# Altium schematic sheet 15_PowerSupply.SchDoc: Board power supply (part 2 of 3)
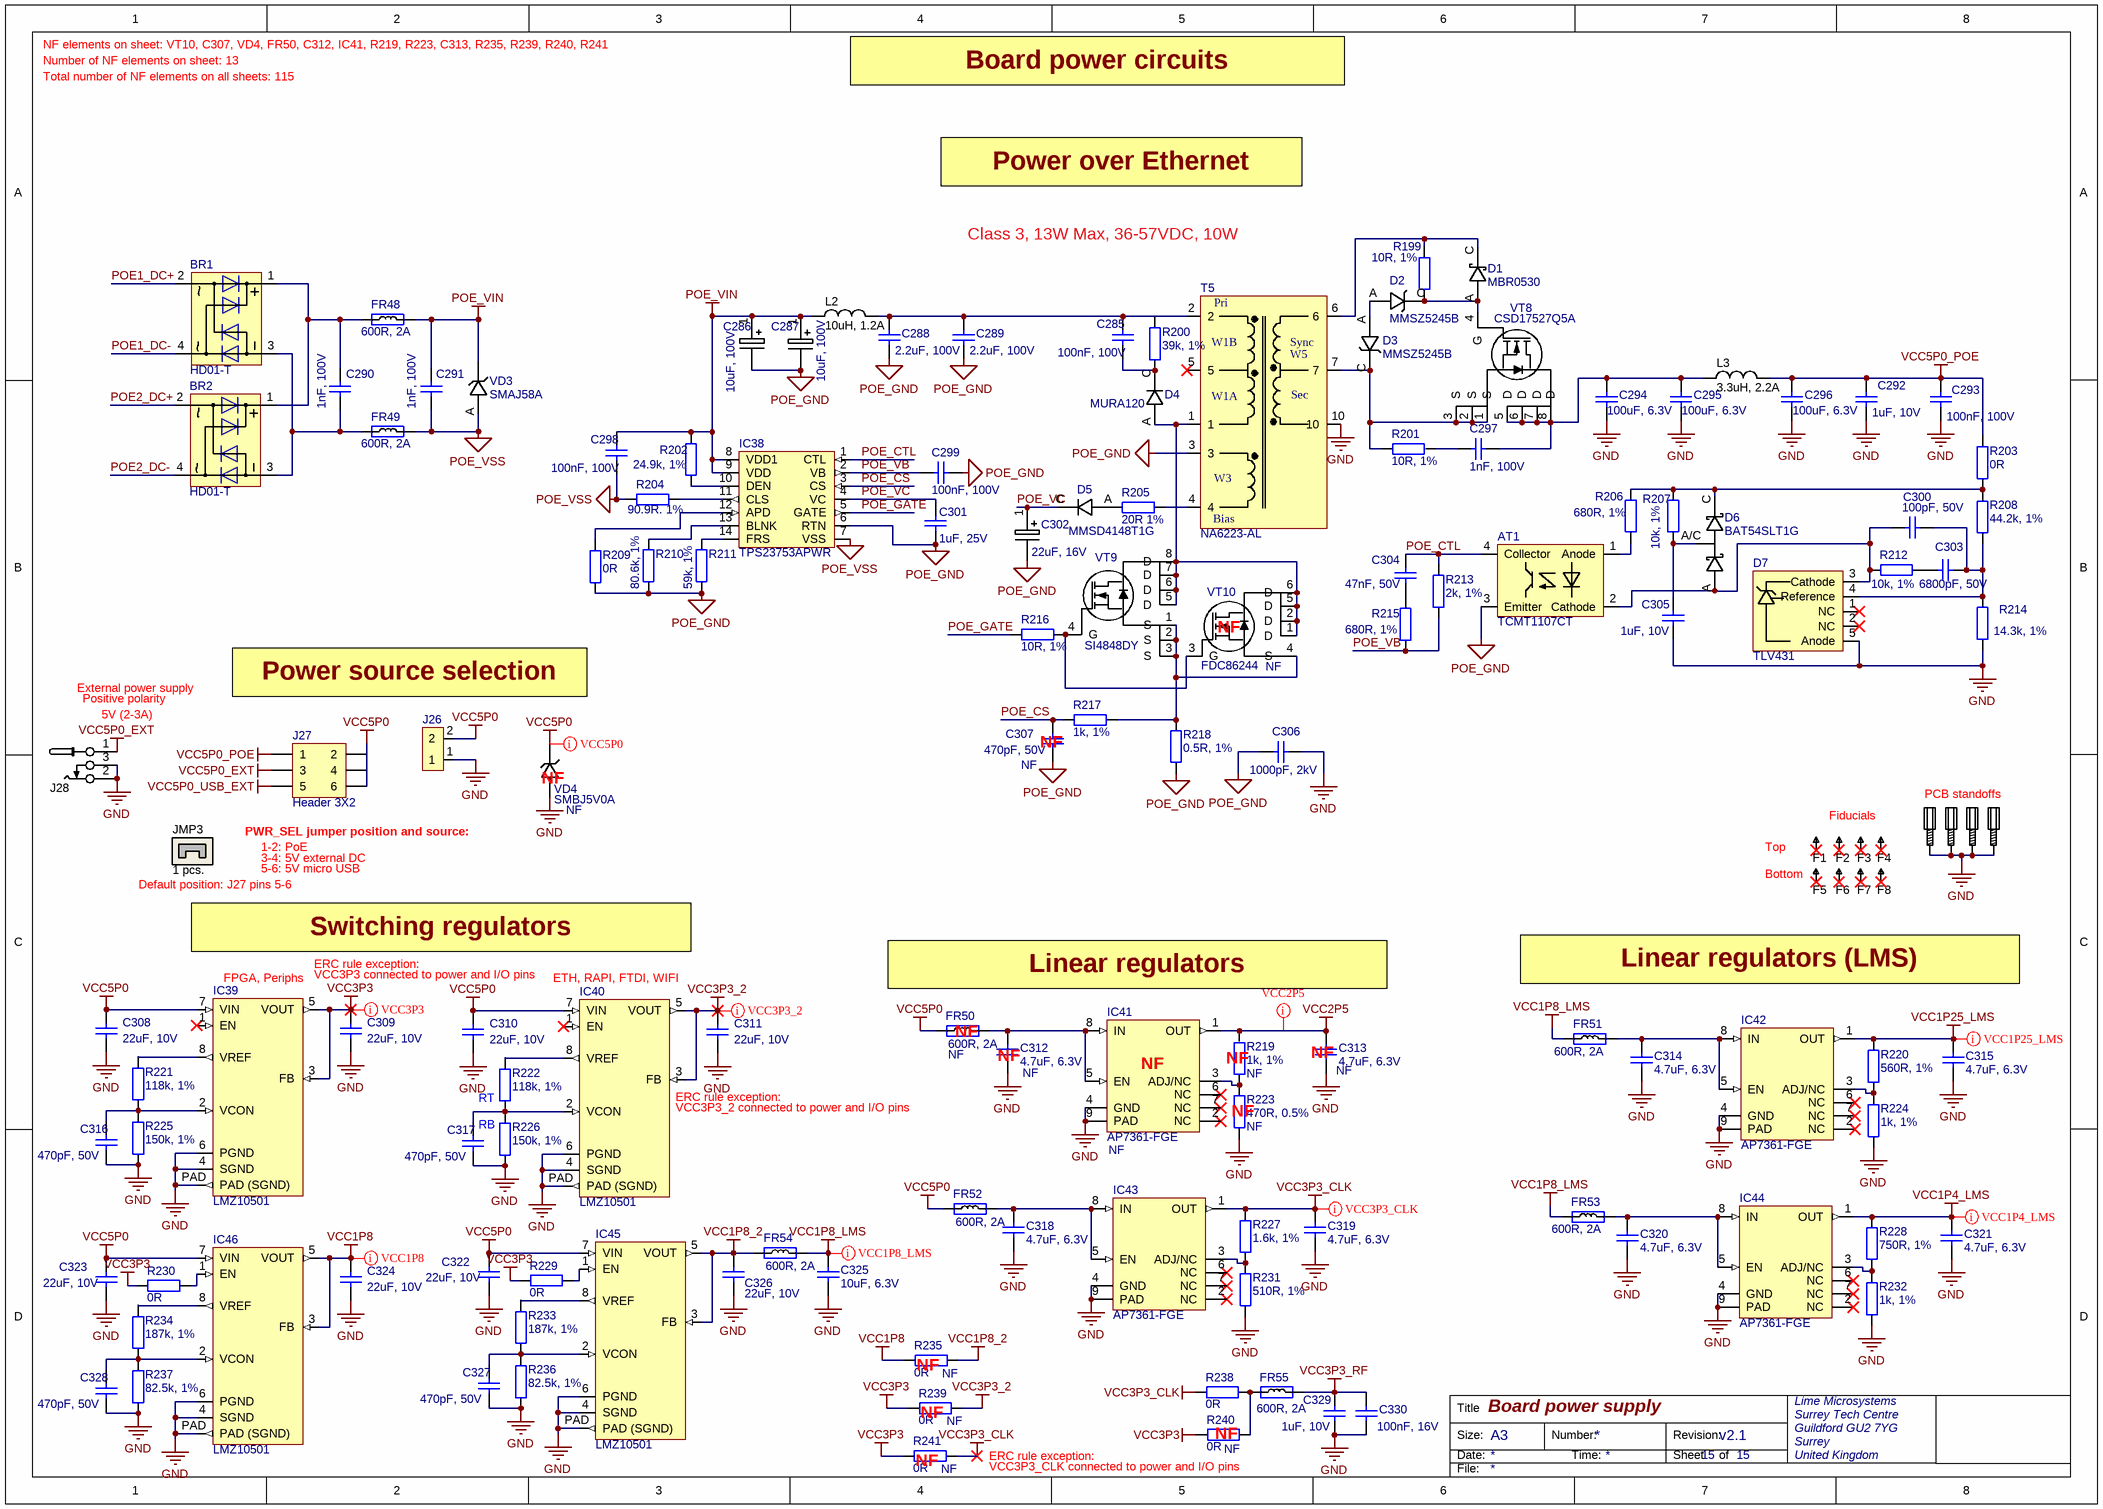
[diagram p1: 15_PowerSupply.SchDoc]
## Library data of the parts
AT1 = TCMT1107CT_optoisolator: Part Description: Optoisolator Transistor Output 5000Vrms 1 Channel 4-SMD; Manufacturer: Vishay Semiconductors; Reverse Breakdown Voltage: 6V; Max Power Dissipation: 250mW; Number of Channels: 1; Output Voltage: 70V; Forward Voltage: 1.6V; Forward Current: 60mA; Rise Time: 3s; Output Current per Channel: 50mA; Collector Emitter Saturation Voltage: 300mV; Isolation Voltage: 3.75kV; Fall Time: 4.7s; Current Transfer Ratio: 160%; ComponentLink1URL: https://www.verical.com/server-webapp/html/getDatasheet?partID=312696; ComponentLink1Description: https://www.verical.com/server-webapp/html/getDatasheet?partID=312696; ComponentLink2URL: https://www.fairchildsemi.com/datasheets/FO/FOD817A.pdf; ComponentLink2Description: https://www.fairchildsemi.com/datasheets/FO/FOD817A.pdf; ComponentLink3URL: http://www.fairchildsemi.com/ds/FO/FOD817A.pdf; ComponentLink3Description: http://www.fairchildsemi.com/ds/FO/FOD817A.pdf; ComponentLink4URL: http://www.fairchildsemi.com/datasheets/FO/FOD817A.pdf; ComponentLink4Description: http://www.fairchildsemi.com/datasheets/FO/FOD817A.pdf; ComponentLink5URL: http://www.mouser.com/ds/2/149/FOD817A-194238.pdf; ComponentLink5Description: http://www.mouser.com/ds/2/149/FOD817A-194238.pdf; ComponentLink6URL: https://www.fairchildsemi.com/datasheets/FO/FOD817D.pdf; ComponentLink6Description: https://www.fairchildsemi.com/datasheets/FO/FOD817D.pdf; Supplier 1: Digi-Key; Manufacturer Part Number 1: TCMT1107; Stock 1: 139303; Pricing 1: 1=0.75, 10=0.585, 25=0.4848, 100=0.418, 250=0.36784, 500=0.31768, 1000=0.2508 (USD); Mount: PCB,Surface Mount; Case/Package: SOP; Number of Pins: 4; Contact Plating: Matte,Tin; Min Operating Temperature: -40°C; Max Operating Temperature: 100°C; Packaging: Tape and Reel; Package Quantity: 1; Collector Emitter Voltage (VCEO): 70V; Max Output Voltage: 70V; Max Collector Current: 50mA; Reverse Voltage (DC): 6V; Number of Elements: 1; Power Dissipation: 250mW; Max Input Current: 60mA; Collector Emitter Breakdown Voltage: 70V; Input Current: 50mA; Voltage Rating (DC): 70V; Voltage: 6V; Radiation Hardening: No; REACH SVHC: No SVHC; Lead Free: Lead Free; ComponentLink7URL: http://www.jameco.com/Jameco/Products/ProdDS/1107109.pdf; ComponentLink7Description: http://www.jameco.com/Jameco/Products/ProdDS/1107109.pdf; ComponentLink8URL: http://www.vishay.com/docs/83510/tcmt1100.pdf; ComponentLink8Description: http://www.vishay.com/docs/83510/tcmt1100.pdf; ComponentLink9URL: http://www.mouser.com/ds/2/427/tcmt1100-103040.pdf; ComponentLink9Description: http://www.mouser.com/ds/2/427/tcmt1100-103040.pdf; ComponentLink10URL: http://www.farnell.com/datasheets/485045.pdf; ComponentLink10Description: http://www.farnell.com/datasheets/485045.pdf; Supplier Part Number 1: TCMT1107CT-ND
BR1 BR2 = HD01-T _RECTIFIER_BRIDGE: Part Description: Bridge Rectifier Single Phase Standard 100V Surface Mount 4-MiniDIP; Manufacturer: Diodes; Max Surge Current: 30A; Forward Voltage: 1V; Peak Reverse Current: 5uA; Forward Current: 400mA; Number of Elements: 1; Max Repetitive Reverse Voltage (Vrrm): 100V; Average Rectified Current: 800mA; Element Configuration: Single; Reverse Voltage (DC): 70V; Capacitance: 10pF; ComponentLink1URL: https://www.diodes.com/assets/Datasheets/ds17001.pdf; ComponentLink1Description: https://www.diodes.com/assets/Datasheets/ds17001.pdf; Supplier 1: Digi-Key; Manufacturer Part Number 1: HD01-T; Stock 1: 186000; Pricing 1: 3000=0.12705, 6000=0.11935, 15000=0.11165, 30000=0.10241, 75000=0.09856 (USD); Mount: Surface Mount; Case/Package: SMD/SMT; Number of Pins: 4; Contact Plating: Matte,Tin; Min Operating Temperature: -55°C; Max Operating Temperature: 150°C; Packaging: Tape and Reel; Package Quantity: 3000; Peak Non-Repetitive Surge Current: 30A; Max Forward Surge Current (Ifsm): 30A; Termination: SMD/SMT; Current Rating: 800mA; Voltage Rating (DC): 100V; Output Current: 800mA; Length: 4.9mm; Height: 2.7mm; Width: 4mm; Radiation Hardening: No; REACH SVHC: No SVHC; Lead Free: Lead Free; ComponentLink2URL: http://www.farnell.com/datasheets/974897.pdf; ComponentLink2Description: http://www.farnell.com/datasheets/974897.pdf; ComponentLink3URL: https://www.verical.com/server-webapp/html/getDatasheet?partID=142523; ComponentLink3Description: https://www.verical.com/server-webapp/html/getDatasheet?partID=142523; ComponentLink4URL: http://www.jameco.com/Jameco/Products/ProdDS/1540412.pdf; ComponentLink4Description: http://www.jameco.com/Jameco/Products/ProdDS/1540412.pdf; ComponentLink5URL: http://www.diodes.com/datasheets/ds17003.pdf; ComponentLink5Description: http://www.diodes.com/datasheets/ds17003.pdf; ComponentLink6URL: http://www.mouser.com/ds/2/115/ds17003-38038.pdf; ComponentLink6Description: http://www.mouser.com/ds/2/115/ds17003-38038.pdf; Supplier Part Number 1: HD01DITR-ND
C285 C293 C298 C299 = Cap_0603: Manufacturer: Murata Electronics North America; Manufacturer Part Number 1: GRM188R72A104KA35D; Part Description: 0.1µF ±10% 100V Ceramic Capacitor X7R 0603 (1608 Metric); Temperature Coefficient: X7R; Tolerance: ±10%; Notification: Current market demand for these product types have resulted in fluctuating and extending lead times. Lead times may differ.; Value: 100nF, 100V; RoHS: RoHS Compliant; Packaging: Cut Tape (CT); Lead Spacing: -; Voltage - Rated: 100V; Package / Case: 0603 (1608 Metric); Category: Capacitors; Supplier 1: Digi-Key; Applications: General Purpose; Ratings: -; Part Status: Not For New Designs; Operating Temperature: -55°C ~ 125°C; Lead Style: -; Size / Dimension: 0.063" L x 0.031" W (1.60mm x 0.80mm); Supplier Part Number 1: 490-3285-1-ND; Height - Seated (Max): -; Features: -; Thickness (Max): 0.035" (0.90mm); Mounting Type: Surface Mount, MLCC
C286 C287 = Cap_ceramic: Part Description: 10µF 100V Aluminum Electrolytic Capacitors Radial, Can - SMD  2000 Hrs @ 85°C; Manufacturer: Panasonic; Manufacturer Part Number 1: EEE2AA100UP; Ripple Current (AC): 50mA; Tolerance: 20%; Life (Hours): 2000Hour; Leakage Current: 3uA; Value: 10uF, 100V; ComponentLink1URL: http://components.arrow.com/part/dataview/41677645S8110057N1386; ComponentLink1Description: http://components.arrow.com/part/dataview/41677645S8110057N1386; ComponentLink2URL: https://www.distrelec.biz/Web/Downloads/_t/ds/PAN-FK_eng_tds.pdf?mime=application%2Fpdf; ComponentLink2Description: https://www.distrelec.biz/Web/Downloads/_t/ds/PAN-FK_eng_tds.pdf?mime=application%2Fpdf; ComponentLink3URL: http://uk.rs-online.com/webdocs/139e/0900766b8139e40f.pdf; ComponentLink3Description: http://uk.rs-online.com/webdocs/139e/0900766b8139e40f.pdf; ComponentLink4URL: http://www.alliedelec.com/m/d/e9dd47fa10a053d1f2828ce8bc944f54.pdf; ComponentLink4Description: http://www.alliedelec.com/m/d/e9dd47fa10a053d1f2828ce8bc944f54.pdf; ComponentLink5URL: https://industrial.panasonic.com/cdbs/www-data/pdf/RDE0000/ABA0000C1181.pdf; ComponentLink5Description: https://industrial.panasonic.com/cdbs/www-data/pdf/RDE0000/ABA0000C1181.pdf; ComponentLink6URL: http://www.farnell.com/datasheets/2002520.pdf; ComponentLink6Description: http://www.farnell.com/datasheets/2002520.pdf; ComponentLink7URL: http://industrial.panasonic.com/www-data/pdf/ABA0000/ABA0000CE120.pdf; ComponentLink7Description: http://industrial.panasonic.com/www-data/pdf/ABA0000/ABA0000CE120.pdf; ComponentLink8URL: http://www.farnell.com/datasheets/731857.pdf; ComponentLink8Description: http://www.farnell.com/datasheets/731857.pdf; ComponentLink9URL: http://www.produktinfo.conrad.com/datenblaetter/425000-449999/443507-da-01-en-SMD_ELKO_VFK_F_22_UF_100V.pdf; ComponentLink9Description: http://www.produktinfo.conrad.com/datenblaetter/425000-449999/443507-da-01-en-SMD_ELKO_VFK_F_22_UF_100V.pdf; Supplier 1: Digi-Key; Supplier Part Number 1: PCE3966CT-ND; Stock 1: 47613; Pricing 1: 1=0.58, 10=0.413, 100=0.2722, 500=0.20166 (USD); Mount: PCB,Surface Mount; Case/Package: Radial; Contact Plating: Tin; Min Operating Temperature: -40°C; Max Operating Temperature: 85°C; Capacitance: 10uF; Voltage Rating: 100V; Packaging: Tape and Reel; Ripple Current: 50mA; Voltage Rating (DC): 100V; Package Quantity: 1; Termination: SMD/SMT; Voltage: 100V; Diameter: 8mm; Length: 6.5mm; Height: 6.2mm; Height - Seated (Max): 0.244inch; Radiation Hardening: No; REACH SVHC: No SVHC; Lead Free: Lead Free; ComponentLink10URL: https://industrial.panasonic.com/cdbs/www-data/pdf/RDE0000/DME0000COL90.pdf; ComponentLink10Description: https://industrial.panasonic.com/cdbs/www-data/pdf/RDE0000/DME0000COL90.pdf; ComponentLink11URL: http://www.industrial.panasonic.com/www-data/pdf/ABA0000/ABA0000CE2.pdf; ComponentLink11Description: http://www.industrial.panasonic.com/www-data/pdf/ABA0000/ABA0000CE2.pdf; ComponentLink12URL: http://www.mouser.com/ds/2/315/ABA0000C1145-947633.pdf; ComponentLink12Description: http://www.mouser.com/ds/2/315/ABA0000C1145-947633.pdf; ComponentLink13URL: http://www.farnell.com/datasheets/2648708.pdf; ComponentLink13Description: http://www.farnell.com/datasheets/2648708.pdf; ComponentLink14URL: http://industrial.panasonic.com/www-data/pdf/ABA0000/ABA0000CE2.pdf; ComponentLink14Description: http://industrial.panasonic.com/www-data/pdf/ABA0000/ABA0000CE2.pdf
C288 C289 = Cap_1206: Manufacturer: TDK Corporation; Part Description: 2.2µF ±10% 100V Ceramic Capacitor X7S 1206 (3216 Metric); Manufacturer Part Number 1: C3216X7S2A225K160AE; Temperature Coefficient: X7S; Tolerance: ±10%; Size / Dimension: 0.126" L x 0.063" W (3.20mm x 1.60mm); Packaging: Cut Tape (CT); Voltage - Rated: 100V; Category: Capacitors; Operating Temperature: -55°C ~ 125°C; Mounting Type: Surface Mount, MLCC; Lead Spacing: -; Ratings: -; Supplier Part Number 1: 445-8900-1-ND; Lead Style: -; Height - Seated (Max): -; Supplier 1: Digi-Key; Applications: Boardflex Sensitive; Features: Soft Termination; RoHS: RoHS Compliant; Part Status: Active; Thickness (Max): 0.075" (1.90mm); Failure Rate: -; Package / Case: 1206 (3216 Metric); Value: 2.2uF, 100V
C290 C291 = Cap_0603: Manufacturer: KEMET; Manufacturer Part Number 1: C0603C102K1RACTU; Part Description: 1000pF ±10% 100V Ceramic Capacitor X7R 0603 (1608 Metric); Tolerance: 10%; Dielectric: X7R; Dielectric Material: Ceramic; Value: 1nF, 100V; Radiation Hardening: No; Length: 1.6mm; Mount: Surface Mount; Case/Package: 0603; Width: 0.8mm; Height: 0.8mm; Dissipation Factor: 10%; Package Quantity: 1; Lead Pitch: 0.7mm; Voltage: 100V; Voltage Rating: 100V; Case Code (Metric): 1608; Termination: SMD/SMT; Thickness: 0.034inch; REACH SVHC: No SVHC; Supplier Part Number 1: 399-7831-2-ND; Min Operating Temperature: -55°C; Voltage Rating (DC): 100V; Case Code (Imperial): 0603; Number of Pins: 2; Packaging: Tape and Reel; Capacitance: 1nF; Max Operating Temperature: 125°C; Supplier 1: Digi-Key; Depth: 0.8mm
C292 C305 C329 = Cap_0402: CAP CER 1UF 10V X5R 0402; Manufacturer: Yageo; Part Description: 1µF 10V Ceramic Capacitor X5R 0402 (1005 Metric) 0.039" L x 0.020" W (1.00mm x 0.50mm); Manufacturer Part Number 1: CC0402MRX5R6BB105; Notification: Current market demand for these product types have resulted in fluctuating and extending lead times. Lead times may differ.; Tolerance: ±20%; Value: 1uF, 10V; Supplier 1: Digi-Key; Supplier Part Number 1: 311-1732-1-ND; RoHS: RoHS Compliant; Applications: General Purpose; Category: Capacitors; ComponentLink1Description: http://www.yageo.com/documents/recent/UPY-GPHC_X5R_4V-to-50V_25.pdf; ComponentLink1URL: http://www.yageo.com/documents/recent/UPY-GPHC_X5R_4V-to-50V_25.pdf; Failure Rate: -; Features: -; Height - Seated (Max): -; Lead Spacing: -; Lead Style: -; Mounting Type: Surface Mount, MLCC; Operating Temperature: -55°C ~ 85°C; Package / Case: 0402 (1005 Metric); Packaging: Cut Tape (CT); Part Status: Active; Pricing 1: 1=0.22, 10=0.156, 100=0.0732, 500=0.0513, 1000=0.04248, 2500=0.03953, 5000=0.03617 (USD); Ratings: -; Size / Dimension: 0.039" L x 0.020" W (1.00mm x 0.50mm); Stock 1: 69600; Temperature Coefficient: X5R; Thickness (Max): 0.022" (0.55mm); Voltage - Rated: 10V
C294-C296 = Cap_1206: Manufacturer: Murata; Manufacturer Part Number 1: GRM32EC70J107ME15L; Part Description: 100µF ±20% 6.3V Ceramic Capacitor X7S 1210 (3225 Metric); Material: Ceramic; Tolerance: 20%; value: 100uF, 6.3V; Supplier 1: Digi-Key; Supplier Part Number 1: 490-10530-1-ND; Stock 1: 129493; Pricing 1: 1=0.75, 10=0.553, 100=0.3795, 500=0.30044 (USD); Mount: Surface Mount; Case/Package: 1210; Case Code (Metric): 3225; Case Code (Imperial): 1210; Min Operating Temperature: -55°C; Max Operating Temperature: 125°C; Packaging: Tape and Reel; Capacitance: 100uF; Voltage Rating: 6.3V; Voltage Rating (DC): 6.3V; Length: 0.126inch; Height: 2.5mm; Width: 0.098inch; Thickness: 0.106inch; Lead Free: Lead Free
C297 = Cap_0603: Manufacturer: KEMET; Manufacturer Part Number 1: C0603C102K1RACTU; Part Description: 1000pF ±10% 100V Ceramic Capacitor X7R 0603 (1608 Metric); Dielectric Material: Ceramic; Tolerance: 10%; Dielectric: X7R; Value: 1nF, 100V; Supplier 1: Digi-Key; Supplier Part Number 1: 399-7831-2-ND; Stock 1: 700000; Pricing 1: 4000=0.01438 (USD); Mount: Surface Mount; Case/Package: 0603; Number of Pins: 2; Case Code (Metric): 1608; Case Code (Imperial): 0603; Min Operating Temperature: -55°C; Max Operating Temperature: 125°C; Capacitance: 1nF; Packaging: Tape and Reel; Voltage Rating: 100V; Voltage Rating (DC): 100V; Package Quantity: 1; Termination: SMD/SMT; Voltage: 100V; Dissipation Factor: 10%; Length: 1.6mm; Height: 0.8mm; Width: 0.8mm; Thickness: 0.034inch; Lead Pitch: 0.7mm; Depth: 0.8mm; Radiation Hardening: No; REACH SVHC: No SVHC; ComponentLink1URL: https://www.verical.com/server-webapp/html/getDatasheet?partID=58478; ComponentLink1Description: https://www.verical.com/server-webapp/html/getDatasheet?partID=58478; ComponentLink2URL: http://www.mouser.com/ds/2/212/KEM_C1002_X7R_SMD-1102033.pdf; ComponentLink2Description: http://www.mouser.com/ds/2/212/KEM_C1002_X7R_SMD-1102033.pdf; ComponentLink3URL: https://www.verical.com/server-webapp/html/getDatasheet?partID=385466; ComponentLink3Description: https://www.verical.com/server-webapp/html/getDatasheet?partID=385466; ComponentLink4URL: http://www.farnell.com/datasheets/2121029.pdf; ComponentLink4Description: http://www.farnell.com/datasheets/2121029.pdf
C300 = Cap_0402: Manufacturer Part Number 1: CC0402JRNPO9BN101; Manufacturer: Yageo; Part Description: 100pF ±5% 50V C0G, NP0 Ceramic Capacitor -55°C ~ 125°C Surface Mount, MLCC 0402 (1005 Metric) 0.039" L x 0.020" W (1.00mm x 0.50mm); Tolerance: ±5%; Temperature Coefficient: C0G, NP0; Value: 100pF, 50V; Capacitance: 100pF; Thickness (Max): 0.022" (0.55mm); Size / Dimension: 0.039" L x 0.020" W (1.00mm x 0.50mm); RoHS: RoHS Compliant; Ratings: -; Package / Case: 0402 (1005 Metric); Mounting Type: Surface Mount, MLCC; Height - Seated (Max): -; Features: -; Lead Spacing: -; Voltage - Rated: 50V; Operating Temperature: -55°C ~ 125°C; Packaging: Cut Tape (CT); Applications: General Purpose; Lead Style: -; Supplier 1: Digi-Key; Category: Capacitors; Supplier Part Number 1: 311-1024-1-ND
C301 = Cap_0603: Manufacturer: Samsung Electro-Mechanics; Manufacturer Part Number 1: CL10A105KA8NNNC; Part Description: 1µF ±10% 25V Ceramic Capacitor X5R 0603 (1608 Metric); Notification: Current market demand for these product types have resulted in fluctuating and extending lead times. Lead times may differ.; Temperature Coefficient: X5R; Tolerance: ±10%; Lead Spacing: -; Lead Style: -; Thickness (Max): 0.035" (0.90mm); Features: -; Operating Temperature: -55°C ~ 85°C; Size / Dimension: 0.063" L x 0.031" W (1.60mm x 0.80mm); Height - Seated (Max): -; Applications: General Purpose; Mounting Type: Surface Mount, MLCC; Package / Case: 0603 (1608 Metric); Ratings: -; Supplier Part Number 1: 1276-1102-1-ND; Packaging: Cut Tape (CT); Voltage - Rated: 25V; RoHS: RoHS Compliant; Supplier 1: Digi-Key; Category: Capacitors; Part Status: Active; Value: 1uF, 25V
C302 = Cap_ceramic: Manufacturer: Panasonic; Manufacturer Part Number 1: EEE-FK1C220UR; Part Description: 22µF 16V Aluminum Electrolytic Capacitors Radial, Can - SMD  2000 Hrs @ 105°C; Material: Aluminium; Tolerance: 20%; Ripple Current: 90mA; ESR (Equivalent Series Resistance): 1.35R; Polarity: Polar; Life (Hours): 2000Hour; Leakage Current: 3uA; Value: 22uF, 16V; Supplier 1: Digi-Key; Supplier Part Number 1: PCE3786CT-ND; Stock 1: 21538; Pricing 1: 1=0.36, 10=0.252, 100=0.1514, 500=0.11356, 1000=0.0959 (USD); Mount: PCB,Surface Mount; Case/Package: Radial; Number of Pins: 2; Contact Plating: Tin; Dielectric Material: Aluminium; Min Operating Temperature: -55°C; Max Operating Temperature: 105°C; Capacitance: 22uF; Packaging: Tape and Reel; Voltage Rating (DC): 16V; Voltage Rating: 16V; Impedance: 1.35R; Package Quantity: 1; Ripple Current (AC): 90mA; Termination: SMD/SMT; Voltage: 16V; Diameter: 4mm; Length: 5.8mm; Height: 5.8mm; Height - Seated (Max): 0.24inch; Width: 5.5mm; Radiation Hardening: No; REACH SVHC: No SVHC; Lead Free: Lead Free; ComponentLink1URL: http://industrial.panasonic.com/www-data/pdf/ABA0000/ABA0000CE120.pdf; ComponentLink1Description: http://industrial.panasonic.com/www-data/pdf/ABA0000/ABA0000CE120.pdf; ComponentLink2URL: http://www.farnell.com/datasheets/2002520.pdf; ComponentLink2Description: http://www.farnell.com/datasheets/2002520.pdf; ComponentLink3URL: http://www.farnell.com/datasheets/1676921.pdf; ComponentLink3Description: http://www.farnell.com/datasheets/1676921.pdf; ComponentLink4URL: https://www.alliedelec.com/m/d/e9dd47fa10a053d1f2828ce8bc944f54.pdf; ComponentLink4Description: https://www.alliedelec.com/m/d/e9dd47fa10a053d1f2828ce8bc944f54.pdf; ComponentLink5URL: http://www.mouser.com/ds/2/315/ABA0000CE120-68386.pdf; ComponentLink5Description: http://www.mouser.com/ds/2/315/ABA0000CE120-68386.pdf; ComponentLink6URL: http://uk.rs-online.com/webdocs/139e/0900766b8139e3f4.pdf; ComponentLink6Description: http://uk.rs-online.com/webdocs/139e/0900766b8139e3f4.pdf; ComponentLink7URL: http://www.produktinfo.conrad.com/datenblaetter/425000-449999/443462-da-01-en-SMD_ELKO_VFK_B_22_UF_16V.pdf; ComponentLink7Description: http://www.produktinfo.conrad.com/datenblaetter/425000-449999/443462-da-01-en-SMD_ELKO_VFK_B_22_UF_16V.pdf
C303 = Cap_0402: Manufacturer: Walsin Technologies; Manufacturer Part Number 1: 0402B682K500CT; Part Description: 6800pF ±10% 50V Ceramic Capacitor X7R 0402 (1005 Metric); Capacitance: 6.8nF; Tolerance: 10%; Dielectric: X7R; Value: 6800pF, 50V; Supplier 1: Digi-Key; Supplier Part Number 1: 1292-1225-1-ND; Stock 1: 95289; Pricing 1: 1=0.1, 10=0.036, 100=0.016, 500=0.01142, 1000=0.00897, 2500=0.00816, 5000=0.0075 (USD); Case/Package: 0402; Case Code (Metric): 1005; Case Code (Imperial): 0402; Min Operating Temperature: -55°C; Max Operating Temperature: 125°C; Packaging: Tape and Reel; Voltage Rating: 50V; Voltage Rating (DC): 50V; Length: 1mm; Depth: 0.5mm; Radiation Hardening: No; REACH SVHC: Unknown; Lead Free: Lead Free; ComponentLink1URL: https://www.verical.com/server-webapp/html/getDatasheet?partID=506879; ComponentLink1Description: https://www.verical.com/server-webapp/html/getDatasheet?partID=506879
C304 = Cap_0603: Manufacturer: Yageo; Manufacturer Part Number 1: CC0603KRX7R9BB473; Part Description: 0.047µF ±10% 50V Ceramic Capacitor X7R 0603 (1608 Metric); Tolerance: 10%; Dielectric: X7R; Value: 47nF, 50V; Supplier 1: Digi-Key; Supplier Part Number 1: 311-1427-1-ND; Stock 1: 1174358; Pricing 1: 1=0.11, 10=0.08, 100=0.0358, 500=0.02558, 1000=0.0201 (USD); Mount: Surface Mount; Case/Package: 0603; Case Code (Metric): 1608; Case Code (Imperial): 0603; Min Operating Temperature: -55°C; Max Operating Temperature: 125°C; Package Quantity: 1; Capacitance: 47nF; Voltage Rating: 50V; Packaging: Tape and Reel; Voltage Rating (DC): 50V; Termination: SMD/SMT; Composition: Ceramic; Voltage: 50V; Length: 1.6mm; Height: 0.8mm; Width: 0.031inch; Thickness: 0.035inch; Depth: 0.8mm; Radiation Hardening: No; REACH SVHC: Unknown; Lead Free: Lead Free; Halogen Free: Halogen Free; ComponentLink1URL: http://www.yageo.com/documents/recent/UPY-GPHC_X7R_6.3V-to-50V_18.pdf; ComponentLink1Description: http://www.yageo.com/documents/recent/UPY-GPHC_X7R_6.3V-to-50V_18.pdf; ComponentLink2URL: http://www.yageo.com/exep/pages/download/literatures/ProductSelectionGuide%202014_Final_2.pdf; ComponentLink2Description: http://www.yageo.com/exep/pages/download/literatures/ProductSelectionGuide%202014_Final_2.pdf; ComponentLink3URL: http://documents.rs-components.com/techlib://itc_doclist_GB.htm?stockno=6698811; ComponentLink3Description: http://documents.rs-components.com/techlib://itc_doclist_GB.htm?stockno=6698811; ComponentLink4URL: http://www.farnell.com/datasheets/1489800.pdf; ComponentLink4Description: http://www.farnell.com/datasheets/1489800.pdf; ComponentLink5URL: https://www.verical.com/server-webapp/html/getDatasheet?partID=403593; ComponentLink5Description: https://www.verical.com/server-webapp/html/getDatasheet?partID=403593
C306 = Cap_1206: Manufacturer Part Number 1: C1812C102KGRACTU; Manufacturer: KEMET; Part Description: 1000pF ±10% 2000V (2kV) Ceramic Capacitor X7R 1812 (4532 Metric); Manufacturer Part Number: C1812C102KGRACAUTO; Tolerance: ±10%; Notification: Current market demand for these product types have resulted in fluctuating and extending lead times. Lead times may differ.; Voltage - Rated: 2000V (2kV); Temperature Coefficient: X7R; Dielectric Material: Ceramic; Capacitance: 1nF; Packaging: Cut Tape (CT); Supplier Part Number 1: 399-3447-1-ND; Supplier 1: Digi-Key; Part Status: Active; Category: Capacitors; RoHS: RoHS Compliant; Mounting Type: Surface Mount, MLCC; Applications: General Purpose; Lead Style: -; Ratings: -; Height - Seated (Max): -; Thickness (Max): 0.061" (1.55mm); Size / Dimension: 0.177" L x 0.126" W (4.50mm x 3.20mm); Package / Case: 1812 (4532 Metric); Failure Rate: -; Lead Spacing: -; Features: High Voltage; Operating Temperature: -55°C ~ 125°C; Value: 1000pF, 2kV; Supplier 2: Digi-Key; Supplier Part Number 2: 399-16774-1-ND; Stock 2: 4004; Pricing 2: 1=0.51, 10=0.355, 100=0.2132, 500=0.1599 (USD); Case/Package: 1812; Weight: 0.000952oz; Case Code (Imperial): 1812; Case Code (Metric): 4532; Min Operating Temperature: -55°C; Max Operating Temperature: 125°C; Voltage Rating (DC): 2kV; Dielectric: X7R; Termination: SMD/SMT; Length: 4.5mm; Width: 3.2mm
C307 C316 C317 C327 C328 = Cap_0402: Manufacturer Part Number 1: C1005C0G1H471J050BA; Manufacturer: TDK Corporation; Part Description: 470pF ±5% 50V Ceramic Capacitor C0G, NP0 0402 (1005 Metric); Tolerance: ±5%; Temperature Coefficient: C0G, NP0; Value: 470pF, 50V; Supplier 1: Digi-Key; Supplier Part Number 1: 445-2656-6-ND; Ratings: -; Package / Case: 0402 (1005 Metric); Capacitance: 470pF; Packaging: Digi-Reel®; RoHS: RoHS Compliant; Lead Style: -; Thickness (Max): 0.022" (0.55mm); Size / Dimension: 0.039" L x 0.020" W (1.00mm x 0.50mm); Lead Spacing: -; Operating Temperature: -55°C ~ 125°C; Height - Seated (Max): -; Applications: General Purpose; Mounting Type: Surface Mount, MLCC; Voltage - Rated: 50V; Category: Capacitors; Features: -
C308-C311 C322-C324 C326 = Cap_0603: Manufacturer Part Number 1: C1608X5R1A226M080AC; Manufacturer: TDK Corporation; Part Description: 22µF ±20% 10V X5R Ceramic Capacitor -55°C ~ 85°C Surface Mount, MLCC 0603 (1608 Metric) 0.063" L x 0.031" W (1.60mm x 0.80mm); Brand: TDK; Temperature Coefficient / Code: +/- 15 %; Tolerance: 20 %; Type: Multilayer Ceramic Chip Capacitor; Supplier 1: Mouser; Supplier Part Number 1: 810-C1608X5R1A226M; Package / Case: 0603 (1608 metric); Category: Multilayer Ceramic Capacitors MLCC - SMD/SMT; Capacitance: 22 uF; Operating Temperature Range: - 55 C to + 85 C; Case Code - in: 0603; Voltage Rating DC: 10 V; Case Code - mm: 1608; Value: 22uF, 10V
C312-C315 C318-C321 = Cap_0402: Manufacturer: Murata Electronics North America; Manufacturer Part Number 1: GRM155R60J475ME87D; Part Description: 4.7µF ±20% 6.3V X5R Ceramic Capacitor -55°C ~ 85°C Surface Mount, MLCC 0402 (1005 Metric) 0.039" L x 0.020" W (1.00mm x 0.50mm); Tolerance: ±20%; Capacitance: 4.7µF; Temperature Coefficient: X5R; Lead Style: -; Ratings: -; Height - Seated (Max): -; Thickness (Max): 0.022" (0.55mm); Voltage - Rated: 6.3V; Packaging: Cut Tape (CT); Lead Spacing: -; Category: Capacitors; Supplier Part Number 1: 490-5408-1-ND; Applications: General Purpose; Operating Temperature: -55°C ~ 85°C; Mounting Type: Surface Mount, MLCC; Features: Derating Recommended; RoHS: RoHS Compliant; Supplier 1: Digi-Key; Package / Case: 0402 (1005 Metric); Size / Dimension: 0.039" L x 0.020" W (1.00mm x 0.50mm); Value: 4.7uF, 6.3V
C325 = Cap_0603: Manufacturer Part Number 1: CC0603MRX5R5BB106; Manufacturer: Yageo; Part Description: 10µF ±20% 6.3V X5R Ceramic Capacitor -55°C ~ 85°C Surface Mount, MLCC 0603 (1608 Metric) 0.063" L x 0.031" W (1.60mm x 0.80mm); Capacitance: 10µF; Tolerance: ±20%; Supplier 1: Digi-Key; Supplier Part Number 1: 311-1448-2-ND; Package / Case: 0603 (1608 Metric); Category: Capacitors; Voltage - Rated: 6.3V; Value: 10uF, 6.3V
C330 = Cap_0603: Manufacturer Part Number 1: GRM155R71C104KA88D; Part Description: CAP CER 0.1UF 16V X7R 0402; Brand: Murata Electronics; Tolerance: 10 %; Type: General Purpose MLCC; Capacitance: 0.1 uF; Temperature Coefficient / Code: +/- 15 %; Case Height: 0.5 mm; Case Length: 1 mm; Dielectric: X7R; Supplier 1: Mouser; Supplier Part Number 1: 81-GRM155R71C104KA88; Case Code - in: 0402; Manufacturer: Murata Electronics; Category: Multilayer Ceramic Capacitors MLCC - SMD/SMT; Voltage Rating DC: 16 V; Value: 100nF, 16V; Manufacturer Part Number: GRM155R71C104KA88D; Case Code - mm: 1005; Case Width: 0.5 mm; Maximum Operating Temperature: + 125 C; Minimum Operating Temperature: - 55 C; Minimum Order Quantity: 1; Operating Temperature Range: - 55 C to + 125 C; Package / Case: 0402 (1005 metric); Packaging: Reel; Product: General Type MLCCs; Product Category: Low & Medium Capacitance SMD Ceramic Chip Capacitors; Reeling: True; RoHS - Mouser: Y; RoHS: RoHS Compliant; Series: GRM; Standard Pack Qty: 10000; Termination Style: SMD/SMT
D1 = MBR0530T1G_shottky_diode: Part Description: Diode Schottky 30V 500mA Surface Mount SOD-123; Manufacturer: ON Semiconductor / Fairchild; Voltage: 30V; Average Rectified Current: 500mA; Element Configuration: Single; Max Surge Current: 5.5A; Max Reverse Leakage Current: 130uA; Forward Voltage: 430mV; Current: 5A; ComponentLink1URL: http://www.mouser.com/ds/2/427/mmsz5225-102133.pdf; ComponentLink1Description: http://www.mouser.com/ds/2/427/mmsz5225-102133.pdf; Supplier 1: Digi-Key; Manufacturer Part Number 1: MBR0530T1G; Stock 1: 121944; Pricing 1: 1 = 0,35000, 10 = 0,28600, 100 = 0,15180, 500 = 0,09986, 1000 = 0,06791 (USD); Mount: Surface Mount; Case/Package: SOD; Number of Pins: 2; Contact Plating: Matte,Tin; Min Operating Temperature: -65°C; Max Operating Temperature: 125°C; Package Quantity: 3000; Packaging: Tape and Reel; Max Reverse Voltage (DC): 30V; Forward Current: 500mA; Max Repetitive Reverse Voltage (Vrrm): 30V; Max Forward Surge Current (Ifsm): 5.5A; Peak Reverse Current: 130uA; Peak Non-Repetitive Surge Current: 5.5A; Length: 2.69mm; Height: 1.12mm; Width: 1.6mm; Radiation Hardening: No; REACH SVHC: No SVHC; ComponentLink2URL: http://www.farnell.com/datasheets/1708258.pdf; ComponentLink2Description: http://www.farnell.com/datasheets/1708258.pdf; ComponentLink3URL: https://www.distrelec.biz/Web/Downloads/26/_e/sz600926_e.pdf?mime=application%2Fpdf; ComponentLink3Description: https://www.distrelec.biz/Web/Downloads/26/_e/sz600926_e.pdf?mime=application%2Fpdf; ComponentLink4URL: http://www.onsemi.com/pub_link/Collateral/MBR0530T1-D.PDF; ComponentLink4Description: http://www.onsemi.com/pub_link/Collateral/MBR0530T1-D.PDF; ComponentLink5URL: http://www.alliedelec.com/m/d/65b97ea0ac6fde880d352b291ad3d7d6.pdf; ComponentLink5Description: http://www.alliedelec.com/m/d/65b97ea0ac6fde880d352b291ad3d7d6.pdf; ComponentLink6URL: http://www.farnell.com/datasheets/85890.pdf; ComponentLink6Description: http://www.farnell.com/datasheets/85890.pdf; ComponentLink7URL: http://www.onsemi.com/pub/Collateral/MBR0530T1-D.PDF; ComponentLink7Description: http://www.onsemi.com/pub/Collateral/MBR0530T1-D.PDF; Supplier Part Number 1: MBR0530T1GOSCT-ND
D2 D3 = MMSZ5245B_shottky_diode: Manufacturer: Vishay Semiconductors; Manufacturer Part Number 1: MMSZ5245B-E3-18; Part Description: Zener Diode 15V 500mW ±5% Surface Mount SOD-123; Zener Voltage: 15V; Max Power Dissipation: 500mW; Impedance: 16R; Voltage Tolerance: 5%; Peak Reverse Current: 100nA; Element Configuration: Single; Supplier 1: Digi-Key; RoHS: Yes; Stock 1: 29874; Pricing 1: 1 = 0,28000, 10 = 0,23300, 25 = 0,19480, 100 = 0,12330, 250 = 0,09516, 500 = 0,08112, 1000 = 0,05516, 2500 = 0,04975, 5000 = 0,04326 (USD); Mount: Surface Mount; Case/Package: SOD-123-2; Weight: 0.000363oz; Min Operating Temperature: -55°C; Max Operating Temperature: 150°C; Packaging: Tape and Reel; Package Quantity: 10000; Tolerance: 5%; ComponentLink1URL: http://www.mouser.com/ds/2/427/mmsz5225-102133.pdf; ComponentLink1Description: http://www.mouser.com/ds/2/427/mmsz5225-102133.pdf; Supplier Part Number 1: MMSZ5245B-E3-18GICT-ND
D4 = MURA120T3G_diode: Part Description: Diode Standard 200V 2A Surface Mount SMA; Manufacturer: ON Semiconductor; Max Surge Current: 40A; Forward Voltage: 875mV; Forward Current: 2A; Peak Reverse Current: 2uA; Recovery Time: 35ns; Max Repetitive Reverse Voltage (Vrrm): 200V; Element Configuration: Single; Polarity: Standard; Output Current: 1A; ComponentLink1URL: http://www.mouser.com/ds/2/427/mmsz5225-102133.pdf; ComponentLink1Description: http://www.mouser.com/ds/2/427/mmsz5225-102133.pdf; ComponentLink2URL: http://www.onsemi.com/pub/Collateral/MMSD4148T1-D.PDF; ComponentLink2Description: http://www.onsemi.com/pub/Collateral/MMSD4148T1-D.PDF; ComponentLink3URL: http://www.farnell.com/datasheets/1707241.pdf; ComponentLink3Description: http://www.farnell.com/datasheets/1707241.pdf; ComponentLink4URL: https://www.verical.com/server-webapp/html/getDatasheet?partID=78734; ComponentLink4Description: https://www.verical.com/server-webapp/html/getDatasheet?partID=78734; Supplier 1: Digi-Key; Manufacturer Part Number 1: MURA120T3G; RoHS: Yes; Stock 1: 48194; Pricing 1: 1 = 0,39000, 10 = 0,31900, 100 = 0,21720, 500 = 0,16288, 1000 = 0,12217 (USD); Case/Package: SMA; Number of Pins: 2; Contact Plating: Matte,Tin; Min Operating Temperature: -65°C; Max Operating Temperature: 175°C; Package Quantity: 1; Packaging: Tape and Reel; Average Rectified Current: 2A; Reverse Recovery Time: 35ns; Peak Non-Repetitive Surge Current: 40A; Max Forward Surge Current (Ifsm): 40A; Voltage Rating (DC): 200V; Current Rating: 2A; Max Reverse Voltage (DC): 200V; Reverse Voltage: 200V; Length: 4.57mm; Height: 2.05mm; Width: 2.92mm; Radiation Hardening: No; REACH SVHC: No SVHC; Lead Free: Lead Free; Halogen Free: Halogen Free; ComponentLink5URL: http://www.onsemi.com/pub/Collateral/MURA115T3-D.PDF; ComponentLink5Description: http://www.onsemi.com/pub/Collateral/MURA115T3-D.PDF; ComponentLink6URL: http://www.jameco.com/Jameco/Products/ProdDS/1100812.pdf; ComponentLink6Description: http://www.jameco.com/Jameco/Products/ProdDS/1100812.pdf; ComponentLink7URL: http://uk.rs-online.com/webdocs/1221/0900766b812212fb.pdf; ComponentLink7Description: http://uk.rs-online.com/webdocs/1221/0900766b812212fb.pdf; ComponentLink8URL: http://www.farnell.com/datasheets/1750742.pdf; ComponentLink8Description: http://www.farnell.com/datasheets/1750742.pdf; Supplier Part Number 1: MURA120T3GOSCT-ND
D5 = MMSD4148T1G_diode: Part Description: Diode Standard 100V 200mA (DC) Surface Mount SOD-123; Manufacturer: ON Semiconductor; Manufacturer Part Number 1: MMSD4148-T1G; Forward Current: 200mA; Reverse Recovery Time: 4ns; Max Repetitive Reverse Voltage (Vrrm): 100V; Peak Non-Repetitive Surge Current: 2A; Element Configuration: Single; Forward Voltage: 1V; Peak Reverse Current: 5uA; Power Dissipation: 425mW; Polarity: Standard; Current Rating: 200A; Capacitance: 4pF; ComponentLink1URL: http://www.mouser.com/ds/2/427/mmsz5225-102133.pdf; ComponentLink1Description: http://www.mouser.com/ds/2/427/mmsz5225-102133.pdf; Supplier 1: Digi-Key; RoHS: Yes; Stock 1: 767963; Pricing 1: 1 = 0,21000, 10 = 0,19200, 100 = 0,10450, 500 = 0,06432, 1000 = 0,04386 (USD); Case/Package: SOD-123-2; Number of Pins: 2; Contact Plating: Matte,Tin; Min Operating Temperature: -55°C; Max Operating Temperature: 150°C; Recovery Time: 4ns; Max Surge Current: 2A; Package Quantity: 1; Packaging: Tape and Reel; Average Rectified Current: 200mA; Max Reverse Voltage (DC): 100V; Max Reverse Leakage Current: 5uA; Max Forward Surge Current (Ifsm): 2A; Voltage Rating (DC): 100V; Output Current: 200mA; Length: 2.69mm; Height: 1.12mm; Width: 1.6mm; Radiation Hardening: No; Lead Free: Lead Free; Halogen Free: Halogen Free; REACH SVHC: No SVHC; ComponentLink2URL: http://www.onsemi.com/pub/Collateral/MMSD4148T1-D.PDF; ComponentLink2Description: http://www.onsemi.com/pub/Collateral/MMSD4148T1-D.PDF; ComponentLink3URL: http://www.farnell.com/datasheets/1707241.pdf; ComponentLink3Description: http://www.farnell.com/datasheets/1707241.pdf; ComponentLink4URL: https://www.verical.com/server-webapp/html/getDatasheet?partID=78734; ComponentLink4Description: https://www.verical.com/server-webapp/html/getDatasheet?partID=78734; Supplier Part Number 1: MMSD4148T1GOSCT-ND
D6 = BAT54SLT1G_shottky_diode: Manufacturer: ON Semiconductor; Part Description: Diode Array 1 Pair Series Connection Schottky 30V 200mA (DC) Surface Mount TO-236-3, SC-59, SOT-23-3; Max Surge Current: 600mA; Forward Current: 200mA; Forward Voltage: 800mV; Peak Reverse Current: 2uA; Recovery Time: 5ns; Element Configuration: Dual; Max Repetitive Reverse Voltage (Vrrm): 30V; Peak Non-Repetitive Surge Current: 1A; Power Dissipation: 225mW; Capacitance: 10pF; Supplier 1: Digi-Key; Manufacturer Part Number 1: BAT54SLT1G; RoHS: Yes; Stock 1: 1449452; Pricing 1: 1 = 0,19000, 10 = 0,17200, 100 = 0,09350, 500 = 0,05756, 1000 = 0,03925 (USD); Case/Package: SOT-23-3; Number of Pins: 3; Contact Plating: Matte,Tin; Min Operating Temperature: -55°C; Max Operating Temperature: 150°C; Packaging: Tape and Reel; Package Quantity: 3000; Average Rectified Current: 200mA; Reverse Recovery Time: 5ns; Max Reverse Leakage Current: 2uA; Current Rating: 200mA; Voltage Rating (DC): 30V; Max Reverse Voltage (DC): 30V; Max Forward Surge Current (Ifsm): 600mA; Length: 2.9mm; Height: 0.94mm; Width: 1.3mm; Radiation Hardening: No; Lead Free: Lead Free; Halogen Free: Halogen Free; REACH SVHC: No SVHC; ComponentLink1URL: http://www.farnell.com/datasheets/1918741.pdf; ComponentLink1Description: http://www.farnell.com/datasheets/1918741.pdf; ComponentLink2URL: http://www.farnell.com/datasheets/2353871.pdf; ComponentLink2Description: http://www.farnell.com/datasheets/2353871.pdf; ComponentLink3URL: https://www.alliedelec.com/m/d/272158a697e3f24d20806a718aa29d59.pdf; ComponentLink3Description: https://www.alliedelec.com/m/d/272158a697e3f24d20806a718aa29d59.pdf; ComponentLink4URL: http://www.onsemi.com/pub/Collateral/BAT54SLT1-D.PDF; ComponentLink4Description: http://www.onsemi.com/pub/Collateral/BAT54SLT1-D.PDF; Supplier Part Number 1: BAT54SLT1GOSCT-ND
D7 = TS431AILT_VREF_ADJ: Manufacturer: Texas Instruments; Manufacturer Part Number 1: TLV431AIDBVR; Part Description: Shunt Voltage Reference IC 6V ±1% 15mA SOT-23-5; Output Voltage: 6V; Max Input Voltage: 7V; Min Input Voltage: 1.24V; Tolerance: 1%; Max Output Current: 15mA; Temperature Coefficient: 129ppm/°C; Number of Channels: 1; Cathode Current: 80uA; Reference Type: Adjustable,Shunt; ComponentLink1URL: https://www.verical.com/server-webapp/html/getDatasheet?partID=139054; ComponentLink1Description: https://www.verical.com/server-webapp/html/getDatasheet?partID=139054; ComponentLink2URL: http://www.st.com/content/ccc/resource/technical/document/datasheet/group1/3f/2e/70/d8/11/ee/47/a9/CD00001336/files/CD00001336.pdf/jcr:content/translations/en.CD00001336.pdf; ComponentLink2Description: http://www.st.com/content/ccc/resource/technical/document/datasheet/group1/3f/2e/70/d8/11/ee/47/a9/CD00001336/files/CD00001336.pdf/jcr:content/translations/en.CD00001336.pdf; ComponentLink3URL: http://www.st.com/web/en/resource/technical/document/datasheet/CD00001336.pdf; ComponentLink3Description: http://www.st.com/web/en/resource/technical/document/datasheet/CD00001336.pdf; ComponentLink4URL: http://www.farnell.com/datasheets/1700526.pdf; ComponentLink4Description: http://www.farnell.com/datasheets/1700526.pdf; ComponentLink5URL: http://www.mouser.com/ds/2/389/ts431-957324.pdf; ComponentLink5Description: http://www.mouser.com/ds/2/389/ts431-957324.pdf; ComponentLink6URL: http://www.produktinfo.conrad.com/datenblaetter/1100000-1199999/001185084-da-01-en-IC_VREF_SHUNT_PRE_TS431AILT_SOT_23_5_STM.pdf; ComponentLink6Description: http://www.produktinfo.conrad.com/datenblaetter/1100000-1199999/001185084-da-01-en-IC_VREF_SHUNT_PRE_TS431AILT_SOT_23_5_STM.pdf; ComponentLink7URL: http://datasheet.iiic.cc/stmicroelectronics/TS431AILT.pdf; ComponentLink7Description: http://datasheet.iiic.cc/stmicroelectronics/TS431AILT.pdf; Value: TLV431; Supplier 1: Digi-Key; Supplier Part Number 1: 296-1984-1-ND; Stock 1: 14941; Pricing 1: 1=0.72, 10=0.636, 100=0.4873, 500=0.38522, 1000=0.30818 (USD); Case/Package: SOT-23; Number of Pins: 5; Weight: 0.000557oz; Min Operating Temperature: -40°C; Max Operating Temperature: 125°C; Package Quantity: 1; Output Current: 15mA; Packaging: Tape and Reel; Reference Voltage: 6V; Max Output Voltage: 6V; Min Output Voltage: 1.24V; Termination: SMD/SMT; Length: 2.9mm; Height: 1.15mm; Width: 1.6mm; Radiation Hardening: No; REACH SVHC: No SVHC; Lead Free: Lead Free; ComponentLink8URL: http://www.ti.com/lit/ds/symlink/tlv431a.pdf; ComponentLink8Description: http://www.ti.com/lit/ds/symlink/tlv431a.pdf; ComponentLink9URL: http://www.jameco.com/Jameco/Products/ProdDS/1100661.pdf; ComponentLink9Description: http://www.jameco.com/Jameco/Products/ProdDS/1100661.pdf; ComponentLink10URL: http://www.farnell.com/datasheets/1887487.pdf; ComponentLink10Description: http://www.farnell.com/datasheets/1887487.pdf; ComponentLink11URL: http://www.ti.com/general/docs/lit/getliterature.tsp?genericPartNumber=TLV431&&fileType=pdf; ComponentLink11Description: http://www.ti.com/general/docs/lit/getliterature.tsp?genericPartNumber=TLV431&&fileType=pdf
FR48-FR55 = Ferrite: Manufacturer Part Number 1: MPZ2012S601AT000; Manufacturer: TDK Corporation; Part Description: FERRITE BEAD 600 OHM 0805 1LN; Filter Type: Differential Mode - Single; Impedance @ Frequency: 600 Ohm @ 100MHz; DC Resistance (DCR): 100 mOhm Max; Supplier 1: Digi-Key; Supplier Part Number 1: 445-2206-2-ND; Mounting Type: Surface Mount; RoHS: RoHS Compliant; Height (Max): 0.041" (1.05mm); Packaging: Tape & Reel (TR); Category: Filters; Current Rating: 2A; Package / Case: 0805 (2012 Metric); Size / Dimension: 0.079" L x 0.049" W (2.00mm x 1.25mm)
  FR48 FR49 FR51 FR53 FR55: Value: 600R, 2A
IC38 = TPS23753A_PoE_controller: Manufacturer: Texas Instruments; Part Description: Power Over Ethernet Controller 1 Channel 802.3at (PoE+), 802.3af (PoE) 14-TSSOP; Max Supply Voltage: 57V; Min Supply Voltage: 0uV; Number of Channels: 1; Max Power Dissipation: 13W; Operating Supply Current: 580uA; On-State Resistance: 1.2R; Turn-Off Delay Time: 60ns; Frequency: 248kHz; Min Current Limit: 405mA; Supplier 1: Digi-Key; Manufacturer Part Number 1: TPS23753APWR; RoHS: Yes; Stock 1: 40952; Pricing 1: 1 = 2,41000, 10 = 2,16200, 100 = 1,73760, 500 = 1,42758, 1000 = 1,18285 (USD); Case/Package: TSSOP; Number of Pins: 14; Contact Plating: Gold; Min Operating Temperature: -40°C; Max Operating Temperature: 125°C; Packaging: Tape and Reel; Package Quantity: 2000; Power Dissipation: 13W; Length: 5mm; Height: 1mm; Radiation Hardening: No; REACH SVHC: No SVHC; Lead Free: Lead Free; ComponentLink1URL: https://www.verical.com/server-webapp/html/getDatasheet?partID=293818; ComponentLink1Description: https://www.verical.com/server-webapp/html/getDatasheet?partID=293818; ComponentLink2URL: http://www.ti.com/lit/ds/symlink/tps23753a.pdf; ComponentLink2Description: http://www.ti.com/lit/ds/symlink/tps23753a.pdf; ComponentLink3URL: http://www.ti.com/general/docs/lit/getliterature.tsp?genericPartNumber=TPS23753A&&fileType=pdf; ComponentLink3Description: http://www.ti.com/general/docs/lit/getliterature.tsp?genericPartNumber=TPS23753A&&fileType=pdf; ComponentLink4URL: http://focus.ti.com/lit/ds/symlink/tps23753a.pdf; ComponentLink4Description: http://focus.ti.com/lit/ds/symlink/tps23753a.pdf; Supplier Part Number 1: 296-39365-1-ND
IC39 IC40 IC45 IC46 = LMZ10501: Manufacturer: Texas Instruments; Manufacturer Part Number 1: LMZ10501SILR; Part Description: n  Non-Isolated PoL Module DC DC Converter 1 Output 0.6 ~ 3.6 V 1A 2.7V - 5.5V Input; Voltage - Input (Min): 2.7V; Voltage - Input (Max): 5.5V; Voltage - Output 1: 0.6 ~ 3.6 V; Current - Output (Max): 1A; Efficiency: 95%; Supplier 1: Digi-Key; RoHS: RoHS Compliant; Category: Power Supplies - Board Mount; Stock 1: 26559; Pricing 1: 1=2.46, 5=2.424, 10=2.388, 25=2.318, 50=2.2478, 100=2.1776, 250=2.1074, 500=1.96688 (USD); Packaging: Cut Tape (CT); Part Status: Active; Type: Non-Isolated PoL Module; Voltage - Output 2: -; Voltage - Output 3: -; Applications: ITE (Commercial); Features: OCP, OTP, UVLO; Operating Temperature: -40°C ~ 125°C; Mounting Type: Surface Mount; Package / Case: 8-LDFN Exposed Pad, Module; Size / Dimension: 0.12" L x 0.10" W x 0.03" H (3.0mm x 2.5mm x 0.7mm); Supplier Device Package: 8-uSIP; ComponentLink1URL: http://www.ti.com/lit/ds/symlink/lmz10501.pdf; ComponentLink1Description: http://www.ti.com/lit/ds/symlink/lmz10501.pdf; Supplier Part Number 1: 296-37104-1-ND
IC41 = AP7361: Manufacturer: Diodes Incorporated; Part Description: IC REG LDO ADJ 1A 8DFN; Manufacturer Part Number 1: AP7361-FGE-7; Regulator Topology: Positive Adjustable; Current - Output: 1A; Current - Limit (Min): 1.1A; Voltage - Dropout (Typical): 0.5V @ 1A; Voltage - Output: 0.8 V ~ 5.5 V; Number of Regulators: 1; Voltage - Input: 2.2 V ~ 6 V; Supplier 1: Digi-Key; Supplier Part Number 1: AP7361-FGE-7DICT-ND; RoHS: RoHS Compliant; Supplier Device Package: U-DFN3030-8; Mounting Type: Surface Mount; Category: Integrated Circuits (ICs); Packaging: Cut Tape (CT); Package / Case: 8-UDFN Exposed Pad; Operating Temperature: -40°C ~ 85°C
IC42-IC44 = AP7361: Manufacturer Part Number 1: AP7361-FGE-7; Manufacturer: Diodes Incorporated; Part Description: IC REG LDO ADJ 1A 8DFN; Regulator Topology: Positive Adjustable; Current - Output: 1A; Current - Limit (Min): 1.1A; Voltage - Dropout (Typical): 0.5V @ 1A; Voltage - Output: 0.8 V ~ 5.5 V; Number of Regulators: 1; Voltage - Input: 2.2 V ~ 6 V; Supplier 1: Digi-Key; Supplier Part Number 1: AP7361-FGE-7DICT-ND; RoHS: RoHS Compliant; Supplier Device Package: U-DFN3030-8; Mounting Type: Surface Mount; Category: Integrated Circuits (ICs); Packaging: Cut Tape (CT); Package / Case: 8-UDFN Exposed Pad; Operating Temperature: -40°C ~ 85°C
J26 = Jumper: Manufacturer Part Number 1: 961102-6404-AR; Part Description: 2 Positions Header, Unshrouded Connector 0.100" (2.54mm) Through Hole Gold; Manufacturer: 3M; Connector Type: Header, Unshrouded; Supplier 1: Digi-Key; Supplier Part Number 1: 3M9447-ND; Contact Type: Male Pin; Color: Black; Mounting Type: Through Hole; Category: Connectors, Interconnects; Contact Finish: Gold
J27 = Header 3X2: Header, 2-Pin, Dual row; Manufacturer: Harwin; Manufacturer Part Number 1: M20-9980346; Part Description: Connector Header Through Hole 6 position 0.100" (2.54mm); Contact Resistance: 25mR; Max Current Rating: 3A; Number of Positions: 6; Gender: Male; Connector Type: Male Pin; Insulation Resistance: 10GR; Pitch: 2.54mm; Row Spacing: 0.1inch; Supplier 1: Digi-Key; Supplier Part Number 1: 952-2121-ND; RoHS: Yes; Stock 1: 46604; Pricing 1: 1 = 0,24000, 10 = 0,22900, 100 = 0,15860, 500 = 0,13420, 1000 = 0,10980, 5000 = 0,09760, 10000 = 0,08845 (USD); Mount: Through Hole; Color: Black; Contact Material: Brass,Bronze; Housing Color: Black; Housing Material: Nylon; Contact Plating: Tin; Min Operating Temperature: -40°C; Max Operating Temperature: 105°C; Package Quantity: 1000; Packaging: Bag; Termination: Solder; Number of Rows: 2; Number of Contacts: 6; Orientation: Straight; Current Rating: 3A; Length: 7.62mm; Depth: 5.08mm; Contact Mating Length: 0.24inch; Radiation Hardening: No; REACH SVHC: No SVHC; ComponentLink1URL: http://uk.rs-online.com/webdocs/1406/0900766b81406898.pdf; ComponentLink1Description: http://uk.rs-online.com/webdocs/1406/0900766b81406898.pdf; ComponentLink2URL: https://www.verical.com/server-webapp/html/getDatasheet?partID=483857; ComponentLink2Description: https://www.verical.com/server-webapp/html/getDatasheet?partID=483857; ComponentLink3URL: http://www.farnell.com/cad/112195.pdf; ComponentLink3Description: http://www.farnell.com/cad/112195.pdf
J28 = CONN_PWR_JACK_2.1x5.5mm: Power Connector, THT, 2.1mm ID, 5.5mm OD; Part Description: Power Barrel Connector Jack 2.10mm ID (0.083"), 5.50mm OD (0.217") Through Hole, Right Angle; Manufacturer: CUI; Manufacturer Part Number 1: PJ-002A; Gender: Male; Shielding: Unshielded; Current Rating: 2.5A; Connector Type: Jack; Voltage Rating: 24V; Insulation Resistance: 50MR; Number of Conductors: 2; ComponentLink1URL: https://www.verical.com/server-webapp/html/getDatasheet?partID=110865; ComponentLink1Description: https://www.verical.com/server-webapp/html/getDatasheet?partID=110865; ComponentLink2URL: http://www.switchcraft.com/Documents/Jack_Schematics.pdf; ComponentLink2Description: http://www.switchcraft.com/Documents/Jack_Schematics.pdf; Supplier 1: Digi-Key; Supplier Part Number 1: CP-002A-ND; RoHS: Yes; Stock 1: 181439; Pricing 1: 1 = 0,60000, 10 = 0,55800, 25 = 0,50240, 50 = 0,44640, 100 = 0,42780, 250 = 0,39060, 500 = 0,37200, 1000 = 0,30690, 2500 = 0,27900 (USD); Mount: Through Hole; Contact Material: Copper,Copper Alloy; Contact Plating: Nickel,Tin; Housing Color: Black; Housing Material: Thermoplastic; Color: Black; Min Operating Temperature: -25°C; Max Operating Temperature: 85°C; Termination: Through Hole; Packaging: Bulk; Package Quantity: 500; Contact Gender: Male; Orientation: Horizontal; Diameter: 2.1mm; Lead Free: Lead Free; Flammability Rating: UL94 V-0
JMP3 = JUMP_2P_CONN_HEADER: Shorting Jumper, 2-position, 1.27mm pitch; Part Description: 2 (1 x 2) Position Shunt Connector Black Closed Top 0.100" (2.54mm) Gold; Manufacturer: Sullins; Manufacturer Part Number 1: SPC02SYAN; Number of Positions: 2; Pitch: 0.1inch; Supplier 1: Digi-Key; Supplier Part Number 1: S9001-ND; Stock 1: 570741; Pricing 1: 1=0.1, 10=0.059, 25=0.044, 50=0.0378, 100=0.0365, 250=0.03152, 500=0.03024, 1000=0.02646, 2500=0.02394 (USD); Colour: Black; Contact Plating: Gold; Package Quantity: 1000; Packaging: Bulk; Height: 0.256inch; Lead Free: Lead Free; ComponentLink1URL: http://www.sullinscorp.com/images/SPC02SYAN-0-3293.pdf; ComponentLink1Description: http://www.sullinscorp.com/images/SPC02SYAN-0-3293.pdf; ComponentLink2URL: https://drawings-pdf.s3.amazonaws.com/11134.pdf; ComponentLink2Description: https://drawings-pdf.s3.amazonaws.com/11134.pdf
L2 = Inductor_0603: Part Description: FIXED IND 10UH 1.2A 180 MOHM SMD; Manufacturer: Taiyo Yuden; Manufacturer Part Number 1: NRS4018T100MDGJ; Core Material: Ferrite; Self Resonant Frequency: 25MHz; Inductance Tolerance: 20%; Saturation Current: 1.3A; Shielding: Shielded; DC Resistance (DCR): 150mR; Test Frequency: 100kHz; Value: 10uH, 1.2A; Supplier 1: Digi-Key; Supplier Part Number 1: 587-2886-1-ND; RoHS: Yes; Stock 1: 60943; Pricing 1: 1 = 0,29000, 10 = 0,26100, 100 = 0,17930, 500 = 0,15324, 1000 = 0,11738 (USD); Mount: Surface Mount; Case/Package: 4018; Number of Pins: 2; Min Operating Temperature: -25°C; Max Operating Temperature: 125°C; Package Quantity: 3500; Packaging: Tape and Reel; Tolerance: 20%; Inductance: 10uh; Current Rating: 1.2A; Max DC Current: 1.2A; Termination: SMD/SMT; Composition: Wirewound; RMS Current (Irms): 1.2A; Length: 4mm; Height: 1.8mm; Width: 4mm; Height - Seated (Max): 0.071inch; Lead Pitch: 2.8mm; Depth: 4.2mm; Radiation Hardening: No; REACH SVHC: No SVHC; Lead Free: Lead Free; Halogen Free: Halogen Free; ComponentLink1URL: https://www.yuden.co.jp/productdata/catalog/en/wound04_e.pdf; ComponentLink1Description: https://www.yuden.co.jp/productdata/catalog/en/wound04_e.pdf; ComponentLink2URL: http://uk.rs-online.com/webdocs/10b3/0900766b810b3cd2.pdf; ComponentLink2Description: http://uk.rs-online.com/webdocs/10b3/0900766b810b3cd2.pdf